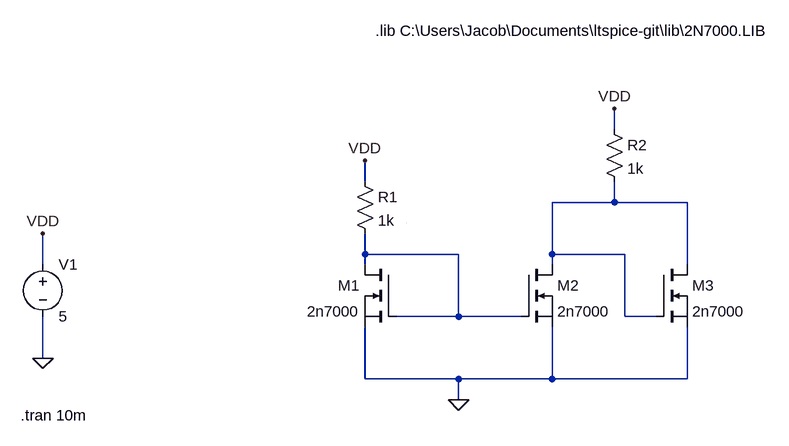
[diagram p0: schematic Draft1.asc]
Draft1.asc, the LTspice schematic file:
Version 4
SHEET 1 880 680
WIRE 320 -144 320 -176
WIRE -64 -64 -64 -96
WIRE 320 -32 320 -64
WIRE 320 -32 224 -32
WIRE 432 -32 320 -32
WIRE -64 48 -64 16
WIRE 80 48 -64 48
WIRE 224 48 224 -32
WIRE 336 48 224 48
WIRE -560 64 -560 16
WIRE -64 64 -64 48
WIRE 224 64 224 48
WIRE 432 64 432 -32
WIRE 80 144 80 48
WIRE 80 144 -16 144
WIRE 176 144 80 144
WIRE 336 144 336 48
WIRE 384 144 336 144
WIRE -560 208 -560 144
WIRE -64 240 -64 160
WIRE 80 240 -64 240
WIRE 224 240 224 160
WIRE 224 240 80 240
WIRE 432 240 432 160
WIRE 432 240 224 240
WIRE 80 272 80 240
WIRE 0 0 0 0
FLAG -560 16 VDD
FLAG -560 208 0
FLAG -64 -96 VDD
FLAG 80 272 0
FLAG 320 -176 VDD
SYMBOL nmos -16 64 M0
SYMATTR InstName M1
SYMATTR Value 2n7000
SYMATTR Prefix X
SYMBOL nmos 176 64 R0
SYMATTR InstName M2
SYMATTR Value 2n7000
SYMATTR Prefix X
SYMBOL res -80 -80 R0
SYMATTR InstName R1
SYMATTR Value 1k
SYMBOL voltage -560 48 R0
WINDOW 123 0 0 Left 0
WINDOW 39 0 0 Left 0
SYMATTR InstName V1
SYMATTR Value 5
SYMBOL nmos 384 64 R0
SYMATTR InstName M3
SYMATTR Value 2n7000
SYMATTR Prefix X
SYMBOL res 304 -160 R0
SYMATTR InstName R2
SYMATTR Value 1k
TEXT -48 -296 Left 2 !.lib C:\\Users\\Jacob\\Documents\\ltspice-git\\lib\\2N7000.LIB
TEXT -594 296 Left 2 !.tran 10m

The netlist it stands for:
* Draft1.asc
XM1 N002 N002 0 2n7000  ; pins D G S
XM2 N001 N002 0 2n7000  ; pins D G S
R1 VDD N002 1k
V1 VDD 0 5
XM3 N001 N001 0 2n7000  ; pins D G S
R2 VDD N001 1k
.lib C:\Users\Jacob\Documents\ltspice-git\lib\2N7000.LIB
.tran 10m
.backanno
.end